# Altium project Joulemeter.PrjPCB
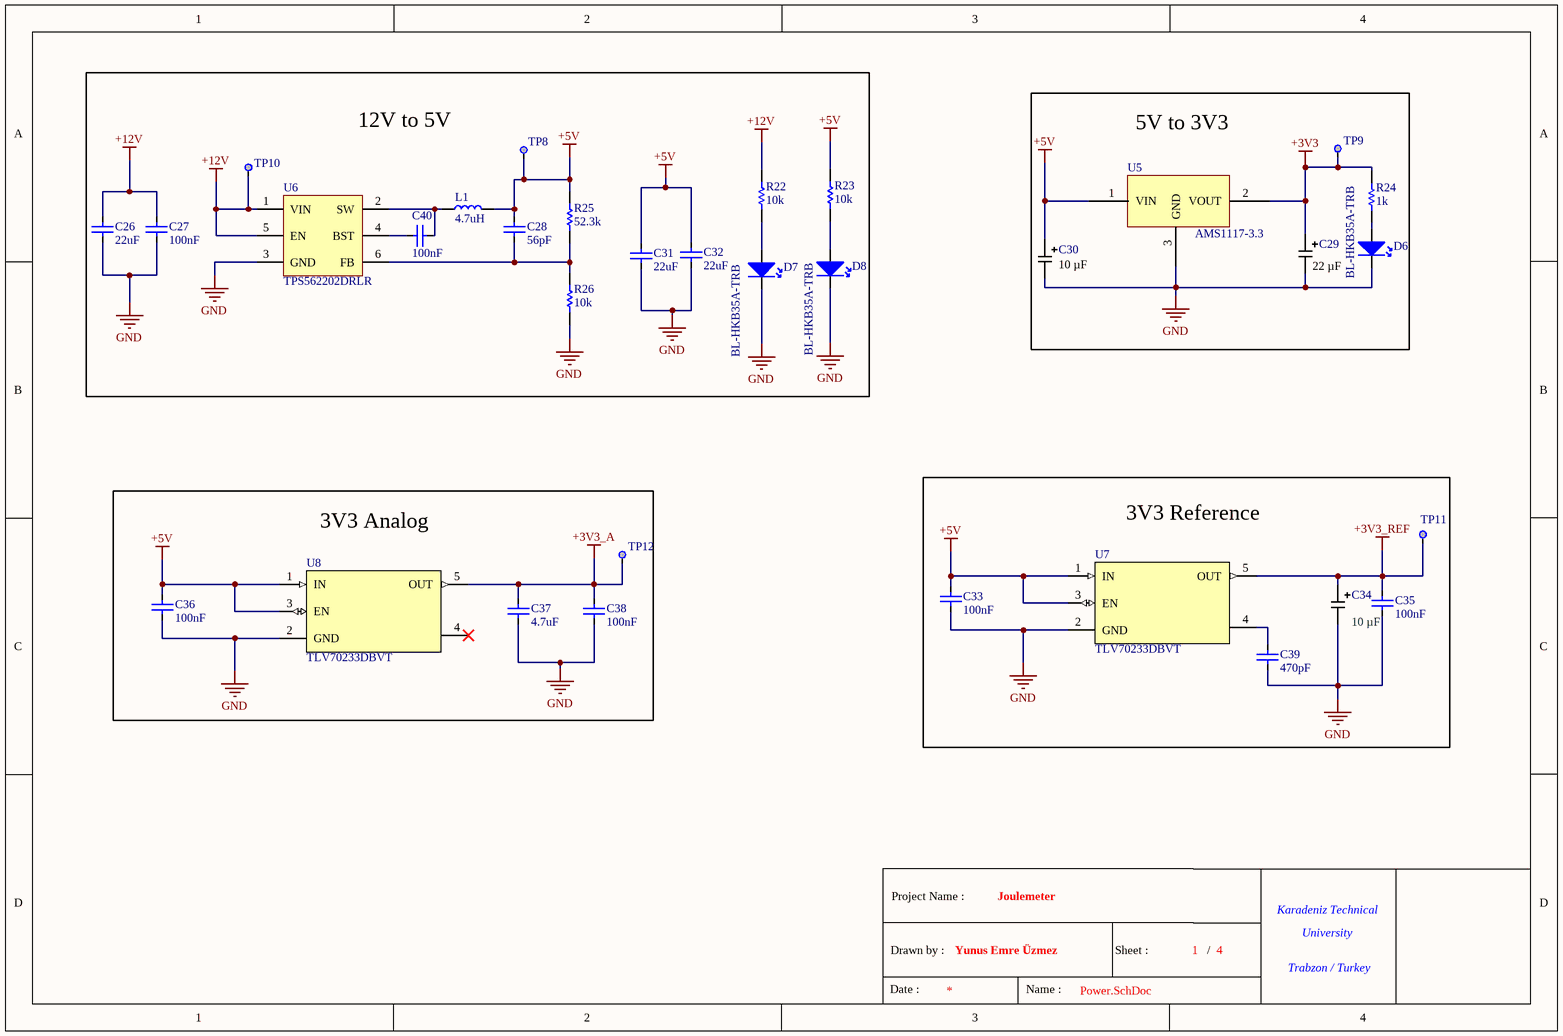
[diagram p0: Power.SchDoc]
Person: Yunus Emre Üzmez; Project: Joulemeter
4 sheets, 130 parts. Net scope: global (net labels, ports and power ports of the same name join across sheets).
Board file: joulmeter.PcbDoc
Sheets:
  Power.SchDoc
  Peripheral.SchDoc
  MCU.SchDoc
  Connectors.SchDoc

## Sheet Power.SchDoc
size A4; DocumentNumber: 1; SheetNumber: 1; SheetTotal: 4

### Parts
(Parts that share a designator on the sheet are numbered #1, #2 ... from top to bottom, then left to right.)
*#1  Title Block  (value not drawn)  (graphical)
C26  22uF  [CAP-1210]
C27  100nF  [CAP-0603]
C28  56pF  [CAP-0603]
C29  Capacitance: 22 µF  [KEMET_CAP_TAN-B]  (hidden comment: T491B226K020AT)
C30  Capacitance: 10 µF  [KEMET_CAP_TAN-B]  (hidden comment: T491B106M016AT)
C31  22uF  [CAP-1210]
C32  22uF  [CAP-1210]
C33  100nF  [CAP-0603]
C34  Capacitance: 10 µF  [KEMET_CAP_TAN-B]  (hidden comment: T491B106M016AT)
C35  100nF  [CAP-0603]
C36  100nF  [CAP-0603]
C37  4.7uF  [CAP-0805]
C38  100nF  [CAP-0603]
C39  470pF  [CAP-0603]
C40  100nF  [CAP-0603]
D6  BL-HKB35A-TRB  [LED-0805]
D7  BL-HKB35A-TRB  [LED-0805]
D8  BL-HKB35A-TRB  [LED-0805]
L1  4.7uH  [IND_EATON_DR125-4R7-R]
R22  10k  [RES-0603]
R23  10k  [RES-0603]
R24  1k  [RES-0603]
R25  52.3k  [RES-0603]
R26  10k  [RES-0603]
TP8  Test Point  [0.8mm Test Point]  (value not drawn)  (no BOM)
TP9  Test Point  [0.8mm Test Point]  (value not drawn)  (no BOM)
TP10  Test Point  [0.8mm Test Point]  (value not drawn)  (no BOM)
TP11  Test Point  [0.8mm Test Point]  (value not drawn)  (no BOM)
TP12  Test Point  [0.8mm Test Point]  (value not drawn)  (no BOM)
U5  AMS1117-3.3  [SOT-223]
U6  TPS562202DRLR  [SOT-563]
U7  TLV70233DBVT  [SOT23-5]
U8  TLV70233DBVT  [SOT23-5]

### Blocks framed on the sheet
12V to 5V: C26-C28 C31 C32 C40 D7 D8 L1 R22 R23 R25 R26 TP8 TP10 U6
5V to 3V3: C29 C30 D6 R24 TP9 U5
3V3 Analog: C36-C38 TP12 U8
3V3 Reference: C33-C35 C39 TP11 U7

### Nets
+3V3: C29.1 R24.1 TP9.1 U5.2(VOUT)
+3V3_A: C37.2 C38.2 TP12.1 U8.5(OUT)
+3V3_REF: C34.1 C35.2 TP11.1 U7.5(OUT)
+5V: C28.2 C30.1 C31.2 C32.2 C33.2 C36.2 L1.2 R23.2 R25.2 TP8.1 U5.1(VIN) U7.1(IN) U7.3(EN) U8.1(IN) U8.3(EN)
+12V: C26.2 C27.2 R22.2 TP10.1 U6.1(VIN) U6.5(EN)
GND: C26.1 C27.1 C29.2 C30.2 C31.1 C32.1 C33.1 C34.2 C35.1 C36.1 C37.1 C38.1 C39.1 D6.2(K) D7.2(K) D8.2(K) R26.1 U5.3(GND) U6.3(GND) U7.2(GND) U8.2(GND)
NetC28_1: C28.1 R25.1 R26.2 U6.6(FB)
NetC39_2: C39.2 U7.4
NetC40_1: C40.1 L1.1 U6.2(SW)
NetC40_2: C40.2 U6.4(BST)
NetD6_1: D6.1(A) R24.2
NetD7_1: D7.1(A) R22.1
NetD8_1: D8.1(A) R23.1

Not connected (* = marked no-connect by the designer): U8 4*

### Notes on the sheet
- (in symbol Title Block) Project Name :; Karadeniz Technical; University; Drawn by :; Sheet :; /; Trabzon / Turkey; Date :; Name :

### Library data of the parts
*#1 = Title Block: Standart Title Block
C26 C31 C32 = CL32B226KAJNNNE: Manufacturer: Samsung Electro-Mechanics; Temperature Coefficient: X7R; Voltage: 25V; Library Reference: Capacitor; Tolerance: %10; Man Code: CL32B226KAJNNNE; Value: 22uF; Footprint: 1210; Component Type: Ceramic Capacitor
C27 C33 C35 C36 C38 C40 = CGA3E2X7R1H104K080AA: Manufacturer: TDK; Temperature Coefficient: X7R; Voltage: 50V; Library Reference: Capacitor; Tolerance: %10; Man Code: CGA3E2X7R1H104K080AA; Value: 100nF; Footprint: 0603; Component Type: Ceramic Capacitor
C28 = GCM1885C2A560FA16D: Manufacturer: Murata; Library Reference: Capacitor; Tolerance: %1; Temperature Coefficient: C0G; Voltage: 100V; Man Code: GCM1885C2A560FA16D; Value: 56pF; Footprint: 0603; Component Type: Ceramic Capacitor
C29 = T491B226K020AT: CAP TANT 22UF 10% 20V 1411; Manufacturer: KEMET; Manufacturer Size Code: B; Type: Molded; ESR (Equivalent Series Resistance): 4 Ohm; Lifetime @ Temp.: 2000 Hrs @ 125°C; Series: T491; Package: Tape & Reel (TR); Tolerance: ±10%; Operating Temperature: -55°C ~ 125°C; Mounting Type: Surface Mount; Package / Case: 1411 (3528 Metric); Size / Dimension: 0.138" L x 0.110" W (3.50mm x 2.80mm); Height - Seated (Max): 0.083" (2.10mm); Lead Spacing: -; Ratings: -; Features: General Purpose; Failure Rate: -; Voltage - Rated: 20 V; Ozdisan Link: https://ozdisan.com/pasif-komponentler/kondansatorler/tantal-kondansatorler/T491B226K020AT; Digikey Link: https://www.digikey.com/en/products/detail/kemet/T491B226K020AT/1842086; Farnell TR Link: https://tr.farnell.com/kemet/t491b226k020at/cap-22-f-20v-10/dp/2321214?st=t491b226k020at; Mouser Link: https://www.mouser.com.tr/ProductDetail/KEMET/T491B226K020AT?qs=2QcrrtqkWlnFmgDgM5wdlA%3D%3D
C30 C34 = T491B106M016AT: CAP TANT 10UF 20% 16V 1411; Manufacturer: KEMET; Manufacturer Size Code: B; Type: Molded; ESR (Equivalent Series Resistance): 2.5 Ohm; Lifetime @ Temp.: 2000 Hrs @ 125°C; Series: T491; Package: Tape & Reel (TR); Tolerance: ±20%; Operating Temperature: -55°C ~ 125°C; Mounting Type: Surface Mount; Package / Case: 1411 (3528 Metric); Size / Dimension: 0.138" L x 0.110" W (3.50mm x 2.80mm); Height - Seated (Max): 0.083" (2.10mm); Lead Spacing: -; Ratings: -; Features: General Purpose; Failure Rate: -; Voltage - Rated: 16 V; Ozdisan Link: https://ozdisan.com/pasif-komponentler/kondansatorler/tantal-kondansatorler/T491B106M016AT; Digikey Link: https://www.digikey.com/en/products/detail/kemet/T495B475M025ZTE750/8764094; Farnell TR Link: https://tr.farnell.com/kemet/t491b106m016at/cap-10-f-16v-20/dp/2462772?st=t491b106m016at; Mouser Link: https://www.mouser.com.tr/ProductDetail/KEMET/T491B106M016AT?qs=WydH9nGI6cAnkEyQJLjSzA%3D%3D
C37 = C0805C475K3RACAUTO: Manufacturer: Kemet; Temperature Coefficient: X7R; Voltage: 25V; Library Reference: Capacitor; Tolerance: %10; Man Code: C0805C475K3RACAUTO; Value: 4.7uF; Footprint: 0805; Component Type: Ceramic Capacitor
C39 = CL10B471KB8NNNC: Manufacturer: Samsung; Voltage: 50V; Tolerance: %10; Component Type: Capacitor; Footprint: 0603; Man Code: CL10B471KB8NNNC; Value: 470pF
D6-D8 = BL-HKB35A-TRB: Manufacturer: BRIGHT LED; Colour: Yellow; Vf: 2.2V; Library Reference: Miscellaneous; Luminous Intensity: 94mcd; If: 20mA; Lens Transparency: Water Clear; Man Code: BL-HKB35A-TRB; Footprint: 0805; Component Type: Led
L1 = DR125-4R7-R: Manufacturer: Eaton; Max Dc Resistance: 10.5mOhm; Tolerance: %20; Max DC Current: 7.18A; Library Reference: Inductor; Man Code: DR125-4R7-R; Value: 4.7uH; Footprint: Surface Mount (12.5mm* 12.5mm); Component Type: Fixed Inductor
R22 R23 R26 = CRCW060310K0FKEA: Manufacturer: Vishay; Tolerance: %1; Power: 0.1W; Library Reference: Resistor; Man Code: CRCW060310K0FKEA; Value: 10k; Footprint: 0603; Component Type: Chip Resistor
R24 = CRCW06031K00FKEAC: Manufacturer: Vishay; Library Reference: Resistor; Tolerance: %1; Power: 0.1W; Man Code: CRCW06031K00FKEAC; Footprint: 0603; Component Type: Chip Resistor; Value: 1k
R25 = ERJ-3EKF5232V: Manufacturer: Panasonic; Tolerance: %1; Power: 0.1W; Library Reference: Resistor; Man Code: ERJ-3EKF5232V; Value: 52.3k; Footprint: 0603; Component Type: Chip Resistor
TP8-TP12 = Test Point: Library Reference: Miscellaneous; Component Type: Test Point
U5 = AMS1117-3.3: Manufacturer: Monolithic; Componenet Type: Regulator; Output Voltage: 3.3V; Output Current: 1A; Man Code: AMS1117-3.3
U6 = TPS562202DRLR: Manufacturer: Texas Instruments; Library Reference: Integrated_Circuit; Man Code: TPS562202DRLR; Component Type: Switcher
U7 U8 = TLV70233DBVT: Manufacturer: TEXAS; Current: 300mA; Voltage: 3.3V; Component Type: LDO; Man Code: TLV70233DBVT

## Sheet Peripheral.SchDoc
size A4; DocumentNumber: 2; SheetNumber: 2; SheetTotal: 4
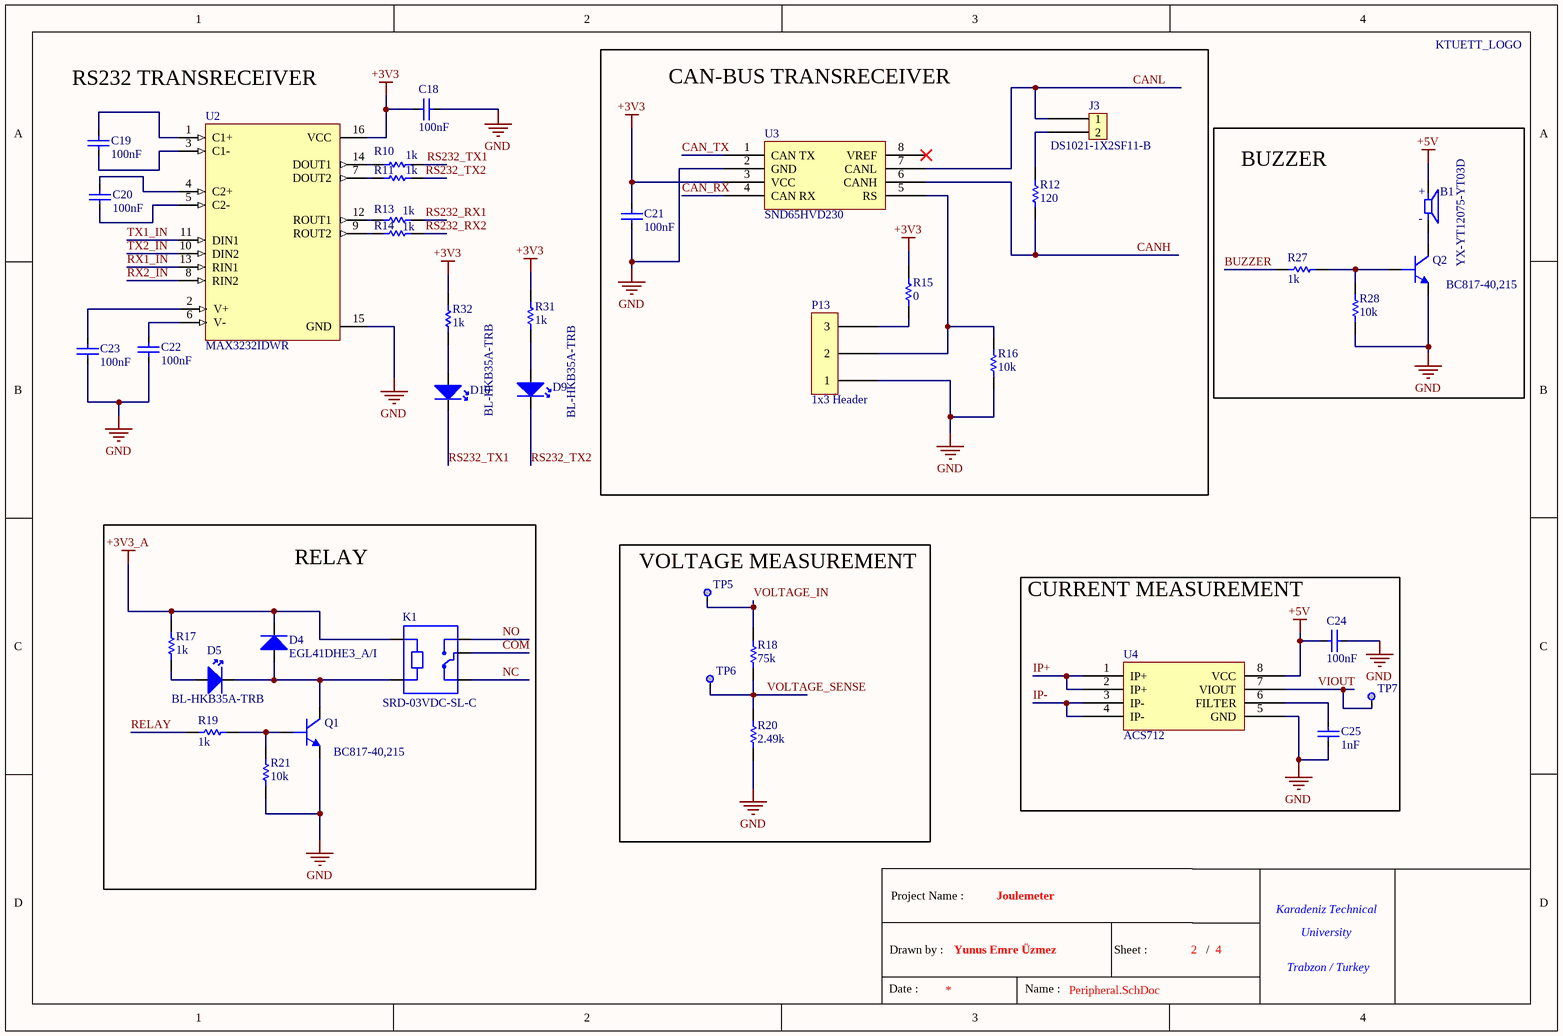
[diagram p1: Peripheral.SchDoc]

### Parts
(Parts that share a designator on the sheet are numbered #1, #2 ... from top to bottom, then left to right.)
1  KTUETT_LOGO  [KTUETT_LOGO]  (value not drawn)  (no BOM)
*#2  Title Block  (value not drawn)  (graphical)
B1  YX-YT12075-YT03D  [BUZZER]
C18  100nF  [CAP-0603]
C19  100nF  [CAP-0603]
C20  100nF  [CAP-0603]
C21  100nF  [CAP-0603]
C22  100nF  [CAP-0603]
C23  100nF  [CAP-0603]
C24  100nF  [CAP-0603]
C25  1nF  [CAP-0603]
D4  EGL41DHE3_A/I  [DO-213AB]
D5  BL-HKB35A-TRB  [LED-0805]
D9  BL-HKB35A-TRB  [LED-0805]
D10  BL-HKB35A-TRB  [LED-0805]
J3  DS1021-1X2SF11-B  [1x2 HEADER]
K1  SRD-03VDC-SL-C  [RELAY]
P13  1x3 Header  [1x3 Header (2.54 mm)]
Q1  BC817-40,215  [SOT23-3]
Q2  BC817-40,215  [SOT23-3]
R10  1k  [RES-0603]
R11  1k  [RES-0603]
R12  120  [RES-0603]
R13  1k  [RES-0603]
R14  1k  [RES-0603]
R15  0  [RES-0603]
R16  10k  [RES-0603]
R17  1k  [RES-0603]
R18  75k  [RES-0603]
R19  1k  [RES-0603]
R20  2.49k  [RES-0603]
R21  10k  [RES-0603]
R27  1k  [RES-0603]
R28  10k  [RES-0603]
R31  1k  [RES-0603]
R32  1k  [RES-0603]
TP5  Test Point  [0.8mm Test Point]  (value not drawn)  (no BOM)
TP6  Test Point  [0.8mm Test Point]  (value not drawn)  (no BOM)
TP7  Test Point  [0.8mm Test Point]  (value not drawn)  (no BOM)
U2  MAX3232IDWR  [SOIC-16]
U3  SND65HVD230  [SOIC-8]
U4  ACS712  [SOIC-8]

### Blocks framed on the sheet
CAN-BUS TRANSRECEIVER: C21 J3 P13 R12 R15 R16 U3
BUZZER: B1 Q2 R27 R28
RELAY: D4 D5 K1 Q1 R17 R19 R21
VOLTAGE MEASUREMENT: R18 R20 TP5 TP6
CURRENT MEASUREMENT: C24 C25 TP7 U4

### Nets
+3V3: C18.2 C21.1 R15.2 R31.2 R32.2 U2.16(VCC) U3.3(VCC)
+3V3_A: D4.2(K) K1.A1 R17.1
+5V: B1.P C24.1 U4.8(VCC)
GND: C18.1 C21.2 C22.2 C23.2 C24.2 C25.1 P13.1 Q1.2(E) Q2.2(E) R16.1 R20.1 R21.1 R28.1 U2.15(GND) U3.2(GND) U4.5(GND)
BUZZER: R27.2
CAN_RX: U3.4(CAN_RX)
CAN_TX: U3.1(CAN_TX)
CANH: R12.2 U3.6(CANH)
CANL: J3.1 U3.7(CANL)
COM: K1.COM
IP+: U4.1(IP+) U4.2(IP+)
IP-: U4.3(IP-) U4.4(IP-)
NC: K1.NC
NO: K1.NO
RELAY: R19.2
RS232_RX1: R13.1
RS232_RX2: R14.1
RS232_TX1: D10.2(K) R10.1
RS232_TX2: D9.2(K) R11.1
RX1_IN: U2.13(RIN1)
RX2_IN: U2.8(RIN2)
TX1_IN: U2.11(DIN1)
TX2_IN: U2.10(DIN2)
VIOUT: TP7.1 U4.7(VIOUT)
VOLTAGE_IN: R18.1 TP5.1
VOLTAGE_SENSE: R18.2 R20.2 TP6.1
NetB1_N: B1.N Q2.3(C)
NetC19_1: C19.1 U2.1(C1+)
NetC19_2: C19.2 U2.3(C1-)
NetC20_1: C20.1 U2.4(C2+)
NetC20_2: C20.2 U2.5(C2-)
NetC22_1: C22.1 U2.6(V-)
NetC23_1: C23.1 U2.2(V+)
NetC25_2: C25.2 U4.6(FILTER)
NetD4_1: D4.1(A) D5.2(K) K1.A2 Q1.3(C)
NetD5_1: D5.1(A) R17.2
NetD9_1: D9.1(A) R31.1
NetD10_1: D10.1(A) R32.1
NetJ3_2: J3.2 R12.1
NetP13_2: P13.2 R16.2 U3.5(RS)
NetP13_3: P13.3 R15.1
NetQ1_1: Q1.1(B) R19.1 R21.2
NetQ2_1: Q2.1(B) R27.1 R28.2
NetR10_2: R10.2 U2.14(DOUT1)
NetR11_2: R11.2 U2.7(DOUT2)
NetR13_2: R13.2 U2.12(ROUT1)
NetR14_2: R14.2 U2.9(ROUT2)

Not connected (* = marked no-connect by the designer): U3 8(VREF)*

### Notes on the sheet
- RS232 TRANSRECEIVER
- (in symbol Title Block) Project Name :; Karadeniz Technical; University; Drawn by :; Sheet :; /; Trabzon / Turkey; Date :; Name :
- (in symbol YX-YT12075-YT03D) +; -

### Library data of the parts
1 = KTUETT_LOGO: Library Reference: Miscellaneous; Component Type: LOGO
*#2 = Title Block: Standart Title Block
B1 = YX-YT12075-YT03D: Manufacturer: YXDZ; Voltage: 3V; Component Type: Buzzer; Man Code: YX-YT12075-YT03D; Mounting Type: THT; Dimensions(mm): 12.00X7.50
C18-C24 = CGA3E2X7R1H104K080AA: as C27 on sheet Power; Man Code: CGA3E2X7R1H104K080AA; Value: 100nF; Footprint: 0603; Component Type: Ceramic Capacitor
C25 = C0603C102F5GACTU: Manufacturer: KEMET; Tolerance: %1; Voltage: 50V; Value: 1nF; Footprint: 0603; Component Type: Chip Capacitor; Man Code: C0603C102F5GACTU
D4 = EGL41DHE3_A/I: Manufacturer: VISHAY; Current: 1A; Voltage: 200; Component Type: Diode; Man Code: EGL41DHE3_A/I
D5 D9 D10 = BL-HKB35A-TRB: as D6 on sheet Power; Man Code: BL-HKB35A-TRB; Footprint: 0805; Component Type: Led
J3 = DS1021-1X2SF11-B: Manufacturer: KLS Electronic; Number of Row: 1; Pitch: 2.54mm; Component Type: Header; Man Code: DS1021-1X2SF11-B; Number of Pins: 2
K1 = SRD-03VDC-SL-C: Manufacturer: Songle; Coil Voltage: 3V; Contact Rating Current: 10A; Component Type: Relay; Man Code: SRD-03VDC-SL-C
P13 = 1x3 Header: Contact Number: 3; Gender: Male; Mounting Angle: 180; Number of Row: 1; Pitch: 2.54 mm; Component Type: Connector; Footprint: *; Library Reference: *; Man Code: 1x3 Header; Mounting Style: THT
Q1 Q2 = BC817-40,215: Library Reference: Transistor; Ic(max): 500mA; VCE(max): 45V; Man Code: BC817-40,215; Component Type: NPN
R10 R11 R13 R14 R17 R19 R27 R31 R32 = CRCW06031K00FKEAC: as R24 on sheet Power; Man Code: CRCW06031K00FKEAC; Footprint: 0603; Component Type: Chip Resistor; Value: 1k
R12 = RC0603FR-07120RL: Manufacturer: YAGEO; Compnenet Type: Chip Resistor; Tolerance: %1; Voltage: 75V; Man Code: RC0603FR-07120RL; Value: 120; Footprint: 0603
R15 = 0603SAJ0000T5E: Manufacturer: ROYALOHM; Tolerance: %5; Voltage: 75V; Component Type: Chip Resistor; Value: 0; Man Code: 0603SAJ0000T5E; Footprint: 0603
R16 R21 R28 = CRCW060310K0FKEA: as R22 on sheet Power; Man Code: CRCW060310K0FKEA; Value: 10k; Footprint: 0603; Component Type: Chip Resistor
R18 = ERJ-3EKF7502V: Manufacturer: Panasonic; Library Reference: Resistor; Tolerance: %1; Power: 0.1W; Man Code: ERJ-3EKF7502V; Footprint: 0603; Component Type: Chip Resistor; Value: 75k
R20 = CRCW06032K49FKEB: Manufacturer: Vishay; Tolerance: %1; Power: 0.1W; Library Reference: Resistor; Man Code: CRCW06032K49FKEB; Value: 2.49k; Footprint: 0603; Component Type: Chip Resistor
TP5-TP7 = Test Point: Library Reference: Miscellaneous; Component Type: Test Point
U2 = MAX3232IDWR: Manufacturer: Texas; Supply Voltage: 3V to 5V; Data Rate: 250kbps; Man Code: MAX3232IDWR; Component Type: IC Driver
U3 = SND65HVD230: Manufacturer: TI; Man Code: SN65HVD230; Component Type: CAN-BUS Transreceiver
U4 = ACS712: Manufacturer: Allegro; Supply Voltage: 5V; Component Type: Hall Effect Sensor; Man Code: ACS712

## Sheet MCU.SchDoc
size A4; DocumentNumber: 3; SheetNumber: 3; SheetTotal: 4
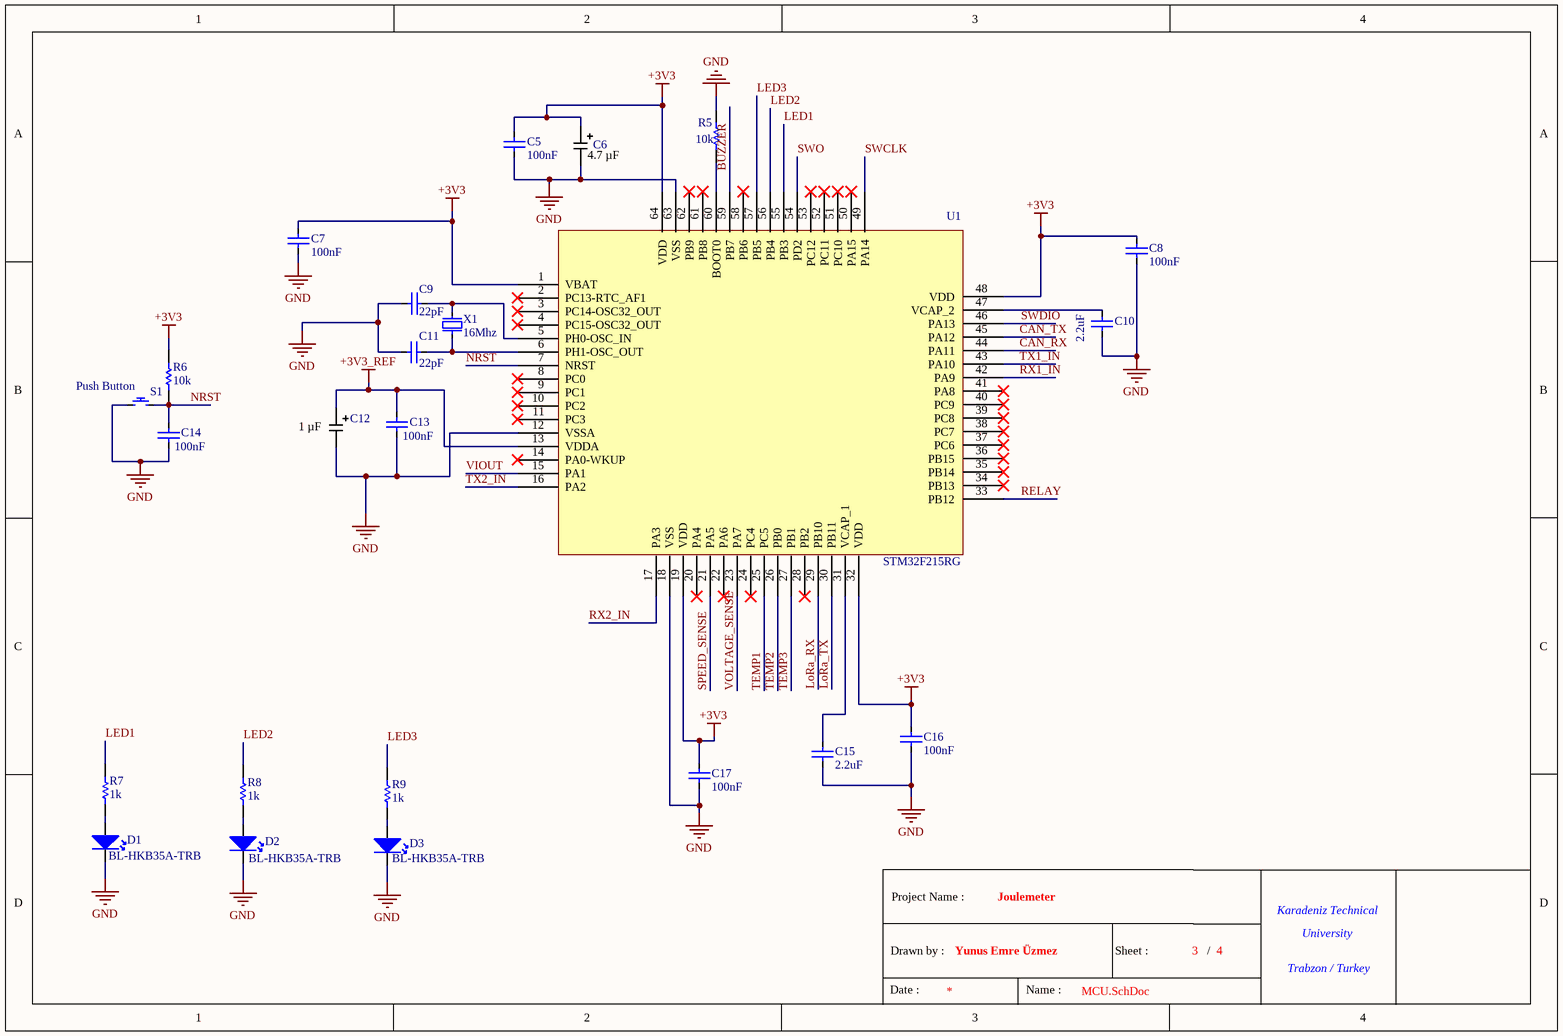
[diagram p2: MCU.SchDoc]

### Parts
(Parts that share a designator on the sheet are numbered #1, #2 ... from top to bottom, then left to right.)
*#3  Title Block  (value not drawn)  (graphical)
C5  100nF  [CAP-0603]
C6  Capacitance: 4.7 µF  [KEMET_CAP_TAN-B]  (hidden comment: T491B475K016AT)
C7  100nF  [CAP-0603]
C8  100nF  [CAP-0603]
C9  22pF  [CAP-0805]
C10  2.2uF  [CAP-0805]
C11  22pF  [CAP-0805]
C12  Capacitance: 1 µF  [KEMET_CAP_TAN-B]  (hidden comment: T491B105K025AT)
C13  100nF  [CAP-0603]
C14  100nF  [CAP-0603]
C15  2.2uF  [CAP-0805]
C16  100nF  [CAP-0603]
C17  100nF  [CAP-0603]
D1  BL-HKB35A-TRB  [LED-0805]
D2  BL-HKB35A-TRB  [LED-0805]
D3  BL-HKB35A-TRB  [LED-0805]
R5  10k  [RES-0603]
R6  10k  [RES-0603]
R7  1k  [RES-0603]
R8  1k  [RES-0603]
R9  1k  [RES-0603]
S1  Push Button  [2.54mm_Push Button]  (no BOM)
U1  STM32F215RG  [LQFP64]
X1  16Mhz  [OSC-THT (11.5*5.00*3.60)]

### Nets
+3V3: C5.2 C6.1 C7.2 C8.2 C16.2 C17.2 R6.1 U1.1(VBAT) U1.19(VDD) U1.32(VDD) U1.48(VDD) U1.64(VDD)
+3V3_REF: C12.1 C13.2 U1.13(VDDA)
GND: C5.1 C6.2 C7.1 C8.1 C9.2 C10.1 C11.1 C12.2 C13.1 C14.1 C15.1 C16.1 C17.1 D1.2(K) D2.2(K) D3.2(K) R5.2 S1.1 U1.12(VSSA) U1.18(VSS) U1.63(VSS)
BUZZER: U1.59(PB7)
CAN_RX: U1.44(PA11)
CAN_TX: U1.45(PA12)
LED1: R7.1 U1.55(PB3)
LED2: R8.1 U1.56(PB4)
LED3: R9.1 U1.57(PB5)
LoRa_RX: U1.29(PB10)
LoRa_TX: U1.30(PB11)
NRST: C14.2 R6.2 S1.2 U1.7(NRST)
RELAY: U1.33(PB12)
RX1_IN: U1.42(PA9)
RX2_IN: U1.17(PA3)
SPEED_SENSE: U1.21(PA5)
SWCLK: U1.49(PA14)
SWDIO: U1.46(PA13)
SWO: U1.54(PD2)
TEMP1: U1.25(PC5)
TEMP2: U1.26(PB0)
TEMP3: U1.27(PB1)
TX1_IN: U1.43(PA10)
TX2_IN: U1.16(PA2)
VIOUT: U1.15(PA1)
VOLTAGE_SENSE: U1.23(PA7)
NetC9_1: C9.1 U1.5(PH0-OSC_IN) X1.2
NetC10_2: C10.2 U1.47(VCAP_2)
NetC11_2: C11.2 U1.6(PH1-OSC_OUT) X1.1
NetC15_2: C15.2 U1.31(VCAP_1)
NetD1_1: D1.1(A) R7.2
NetD2_1: D2.1(A) R8.2
NetD3_1: D3.1(A) R9.2
NetR5_1: R5.1 U1.60(BOOT0)

Not connected (* = marked no-connect by the designer): U1 2(PC13-RTC_AF1)* 3(PC14-OSC32_OUT)* 4(PC15-OSC32_OUT)* 8(PC0)* 9(PC1)* 10(PC2)* 11(PC3)* 14(PA0-WKUP)* 20(PA4)* 22(PA6)* 24(PC4)* 28(PB2)* 34(PB13)* 35(PB14)* 36(PB15)* 37(PC6)* 38(PC7)* 39(PC8)* 40(PC9)* 41(PA8)* 50(PA15)* 51(PC10)* 52(PC11)* 53(PC12)* 58(PB6)* 61(PB8)* 62(PB9)*

### Notes on the sheet
- (in symbol Title Block) Project Name :; Karadeniz Technical; University; Drawn by :; Sheet :; /; Trabzon / Turkey; Date :; Name :

### Library data of the parts
*#3 = Title Block: Standart Title Block
C5 C7 C8 C13 C14 C16 C17 = CGA3E2X7R1H104K080AA: as C27 on sheet Power; Man Code: CGA3E2X7R1H104K080AA; Value: 100nF; Footprint: 0603; Component Type: Ceramic Capacitor
C6 = T491B475K016AT: CAP TANT 4.7UF 10% 16V 1411; Manufacturer: KEMET; Manufacturer Size Code: B; Type: Molded; ESR (Equivalent Series Resistance): 3.5 Ohm; Lifetime @ Temp.: 2000 Hrs @ 125°C; Series: T491; Package: Tape & Reel (TR); Tolerance: ±10%; Operating Temperature: -55°C ~ 125°C; Mounting Type: Surface Mount; Package / Case: 1411 (3528 Metric); Size / Dimension: 0.138" L x 0.110" W (3.50mm x 2.80mm); Height - Seated (Max): 0.083" (2.10mm); Lead Spacing: -; Ratings: -; Features: General Purpose; Failure Rate: -; Voltage - Rated: 16 V; Ozdisan Link: https://ozdisan.com/pasif-komponentler/kondansatorler/tantal-kondansatorler/T491B475K016AT; Digikey Link: https://www.digikey.com/en/products/detail/kemet/T491B475K016AT/818582; Farnell TR Link: https://tr.farnell.com/kemet/t491b475k016at/cap-4-7-f-16v-10-smd/dp/1457453?st=t491b475k016at; Mouser Link: https://www.mouser.com.tr/ProductDetail/KEMET/T491B475K016AT?qs=pWsseJt92L15yATvg%252BRzxw%3D%3D
C9 C11 = CL21C220JBANNNC: Manufacturer: Samsung Electro-Mechanics; Temperature Coefficient: C0G; Voltage: 50V; Library Reference: Capacitor; Tolerance: %5; Man Code: CL21C220JBANNNC; Value: 22pF; Footprint: 0805; Component Type: Ceramic Capacitor
C10 C15 = CL21B225KAFVPNE_1: Manufacturer: Samsung Electro-Mechanics; Library Reference: Capacitor; Temperature Coefficient: X7R; Tolerance: %10; Voltage: 25V; Component Type: Ceramic Capacitor; Footprint: 0805; Man Code: CL21B225KAFVPNE; Value: 2.2uF
C12 = T491B105K025AT: CAP TANT 1UF 10% 25V 1411; Manufacturer: KEMET; Manufacturer Size Code: B; Type: Molded; ESR (Equivalent Series Resistance): 5 Ohm; Lifetime @ Temp.: 2000 Hrs @ 125°C; Series: T491; Package: Tape & Reel (TR); Tolerance: ±10%; Operating Temperature: -55°C ~ 125°C; Mounting Type: Surface Mount; Package / Case: 1411 (3528 Metric); Size / Dimension: 0.138" L x 0.110" W (3.50mm x 2.80mm); Height - Seated (Max): 0.083" (2.10mm); Lead Spacing: -; Ratings: -; Features: General Purpose; Failure Rate: -; Voltage - Rated: 25 V; Ozdisan Link: https://ozdisan.com/pasif-komponentler/kondansatorler/tantal-kondansatorler/T491B105K025AT; Digikey Link: https://www.digikey.com/en/products/detail/kemet/T491B105K025AT/3724810; Farnell TR Link: https://tr.farnell.com/kemet/t491b105k025at/cap-1-f-25v-10/dp/2321211?st=t491b105k025at; Mouser Link: https://www.mouser.com.tr/ProductDetail/KEMET/T491B105K025AT?qs=MSnLt6VizIVP1rbCgJ%252B8hw%3D%3D
D1-D3 = BL-HKB35A-TRB: as D6 on sheet Power; Man Code: BL-HKB35A-TRB; Footprint: 0805; Component Type: Led
R5 R6 = CRCW060310K0FKEA: as R22 on sheet Power; Man Code: CRCW060310K0FKEA; Value: 10k; Footprint: 0603; Component Type: Chip Resistor
R7-R9 = CRCW06031K00FKEAC: as R24 on sheet Power; Man Code: CRCW06031K00FKEAC; Footprint: 0603; Component Type: Chip Resistor; Value: 1k
S1 = Push Button: Library Reference: Other Switches; Component Type: Push Button
U1 = STM32F215RG: Manufacturer: STM; Speed: 120 mHz; Program Memory Size: 1 MB; Supply Voltage: 1.8V-3.6V; Number of Bits: 32; Number of I/O: 51; Component Type: Microcontroller; Man Code: STM32F215RG
X1 = AS49S-16M-FC160F3: Manufacturer: ANSEN; Frequency Tolerance: 20ppm; Frequency Stability: 50ppm; Library Reference: Miscellaneous; Capacitance: 16pF; ESR: 30ohm; Man Code: AS49S-16M-FC160F3; Value: 16Mhz; Component Type: Crystal Oscillator; Footprint: THT (11.5*5.00*3.60)

## Sheet Connectors.SchDoc
size A4; DocumentNumber: 4; SheetNumber: 4; SheetTotal: 4
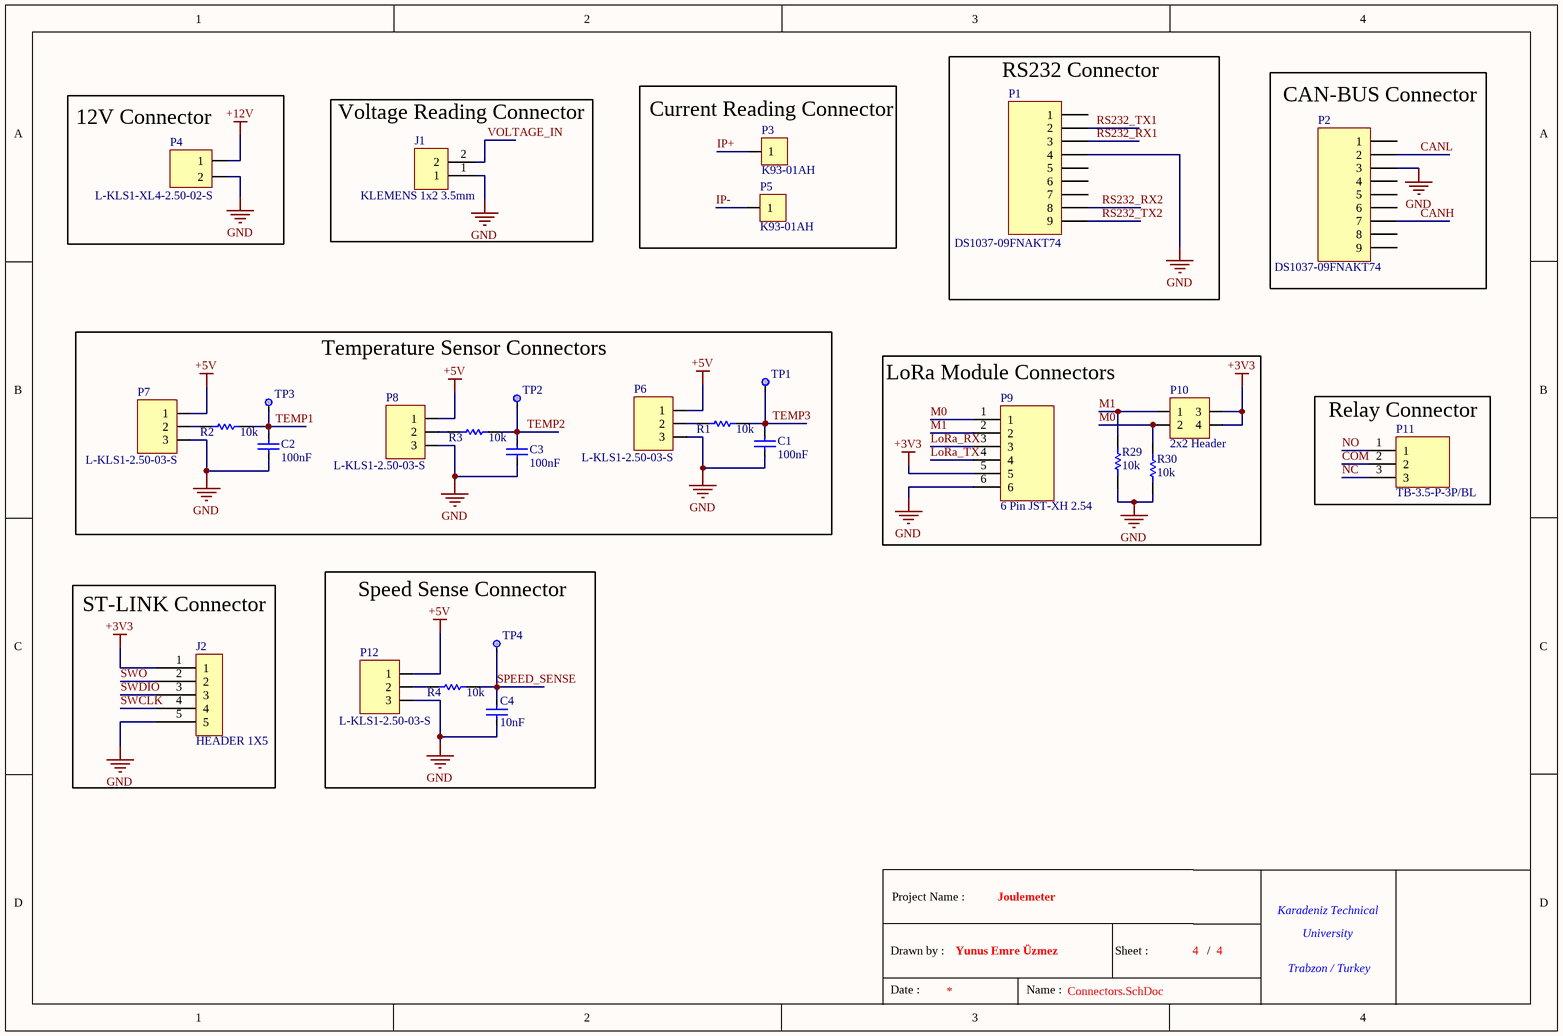
[diagram p3: Connectors.SchDoc]

### Parts
(Parts that share a designator on the sheet are numbered #1, #2 ... from top to bottom, then left to right.)
*#4  Title Block  (value not drawn)  (graphical)
C1  100nF  [CAP-0603]
C2  100nF  [CAP-0603]
C3  100nF  [CAP-0603]
C4  10nF  [CAP-0603]
J1  KLEMENS 1x2 3.5mm  [Klemens 1X2 3.5mm]
J2  HEADER 1X5  [Header 2.54 1x5]
P1  DS1037-09FNAKT74  [D SUB 9PIN FEMALE 90C TH]
P2  DS1037-09FNAKT74  [D SUB 9PIN FEMALE 90C TH]
P3  K93-01AH  [TERM.BLK.5.00MM BARRIER TYPE]
P4  L-KLS1-XL4-2.50-02-S  [2 PIN MALE 180C TH 2.50MM]
P5  K93-01AH  [TERM.BLK.5.00MM BARRIER TYPE]
P6  L-KLS1-2.50-03-S  [3PIN MALE 180C TH 2.5mm]
P7  L-KLS1-2.50-03-S  [3PIN MALE 180C TH 2.5mm]
P8  L-KLS1-2.50-03-S  [3PIN MALE 180C TH 2.5mm]
P9  6 Pin JST-XH 2.54  [1x6 2.50mm TUNIC CONNECTOR]
P10  2x2 Header  [2x2 Header (2.54mm)]
P11  TB-3.5-P-3P/BL  [1x3 3.50MM TERMINAL BLOCK]
P12  L-KLS1-2.50-03-S  [3PIN MALE 180C TH 2.5mm]
R1  10k  [RES-0603]
R2  10k  [RES-0603]
R3  10k  [RES-0603]
R4  10k  [RES-0603]
R29  10k  [RES-0603]
R30  10k  [RES-0603]
TP1  Test Point  [0.8mm Test Point]  (value not drawn)  (no BOM)
TP2  Test Point  [0.8mm Test Point]  (value not drawn)  (no BOM)
TP3  Test Point  [0.8mm Test Point]  (value not drawn)  (no BOM)
TP4  Test Point  [0.8mm Test Point]  (value not drawn)  (no BOM)

### Blocks framed on the sheet
Current Reading Connector: P3 P5
RS232 Connector: P1
CAN-BUS Connector: P2
12V Connector: P4
Voltage Reading Connector: J1
Temperature Sensor Connectors: C1-C3 P6-P8 R1-R3 TP1-TP3
LoRa Module Connectors: P9 P10 R29 R30
Relay Connector: P11
ST-LINK Connector: J2
Speed Sense Connector: C4 P12 R4 TP4

### Nets
+3V3: J2.1 P9.5 P10.3 P10.4
+5V: P6.1 P7.1 P8.1 P12.1
+12V: P4.1
GND: C1.1 C2.1 C3.1 C4.1 J1.1 J2.5 P1.4 P2.3 P4.2 P6.3 P7.3 P8.3 P9.6 P12.3 R29.1 R30.1
CANH: P2.7
CANL: P2.2
COM: P11.2
IP+: P3.1
IP-: P5.1
LoRa_RX: P9.3
LoRa_TX: P9.4
M0: P9.1 P10.2 R30.2
M1: P9.2 P10.1 R29.2
NC: P11.3
NO: P11.1
RS232_RX1: P1.3
RS232_RX2: P1.8
RS232_TX1: P1.2
RS232_TX2: P1.9
SPEED_SENSE: C4.2 R4.1 TP4.1
SWCLK: J2.4
SWDIO: J2.3
SWO: J2.2
TEMP1: C2.2 R2.1 TP3.1
TEMP2: C3.2 R3.1 TP2.1
TEMP3: C1.2 R1.1 TP1.1
VOLTAGE_IN: J1.2
NetP6_2: P6.2 R1.2
NetP7_2: P7.2 R2.2
NetP8_2: P8.2 R3.2
NetP12_2: P12.2 R4.2

Not connected (* = marked no-connect by the designer): P1 1 5 6 7; P2 1 4 5 6 8 9

### Notes on the sheet
- (in symbol Title Block) Project Name :; Karadeniz Technical; University; Drawn by :; Sheet :; /; Trabzon / Turkey; Date :; Name :

### Library data of the parts
*#4 = Title Block: Standart Title Block
C1-C3 = CGA3E2X7R1H104K080AA: as C27 on sheet Power; Man Code: CGA3E2X7R1H104K080AA; Value: 100nF; Footprint: 0603; Component Type: Ceramic Capacitor
C4 = 06031C103K4T4A: Manufacturer: AVX; Temperature Coefficient: X7R; Voltage: 100V; Library Reference: Capacitor; Tolerance: %10; Man Code: 06031C103K4T4A; Value: 10nF; Footprint: 0603; Component Type: Ceramic Capacitor
J1 = KLEMENS 1x2 3.5mm: 1x2 3.5mm Klemens
J2 = HEADER 1X5: 2.54mm 1x5 Header
P1 P2 = DS1037-09FNAKT74: Manufacturer: CONNFLY; Library Reference: Connector; Mating Connector: L-KLS1-213-09-M-L; Gender: Female; Contact Number: 9; Number of Row: 2; Mounting Angle: 90; Current(max): 1.5A; Contact Resistance(max): 20mohm; Pitch: 2.77mm; Man Code: DS1037-09FNAKT74; Component Type: D SUB 9 PIN Female Connector; Mounting Style: Through Hole
P3 P5 = K93-01AH: Manufacturer: GAOSONG; Library Reference: Connector; Mating Connector: M4 Screw; Gender: Male; Contact Number: 4; Number of Row: 2; Mounting Angle: 180; Current(max): 25A; Pitch: 5-7mm; Man Code: K93-01AH; Component Type: TERM.BLK.5.00MM BARRIER TYPE; Mounting Style: Through Hole; Contact Resistance(max): -
P4 = L-KLS1-XL4-2.50-02-S: Manufacturer: KLS ELECTRONIC; Contact Number: 3; Contact Resistance (Max): 10mohm; Current(Max): 3A; Gender: Male; Mounting Angle: 180; Number of Row: 1; Pitch: 2.50mm; Component Type: CONN 2PIN MALE 180C TH 2.5mm; Mounting Style: THT; Man Code: L-KLS1-XL4-2.50-02-S
P6-P8 P12 = L-KLS1-2.50-03-S: Manufacturer: KLS ELECTRONIC; Library Reference: Connector; Mating Connector: L-KLS1-2.50-03-H; Gender: Male; Contact Number: 3; Number of Row: 1; Mounting Angle: 180; Current(max): 3A; Contact Resistance(max): 10mohm; Pitch: 2.5mm; Man Code: L-KLS1-2.50-03-S; Component Type: CONN 3PIN MALE 180C TH 2.5mm; Mounting Style: Through Hole
P9 = 6 Pin JST-XH 2.54: Manufacturer: CONNFLY; Pin Number: 6; Pitch: 2.54mm; Component Type: Connector; Number of rows: 1; Man Code: 6 Pin JST-XH 2.54; Mounting Type: THT
P10 = 2x2 Header (2.54mm): Library Reference: Connector; Gender: Male; Contact Number: 4; Number of Row: 2; Mounting Angle: 180; Pitch: 2.54mm; Man Code: 2x2 Header; Component Type: Header; Manufacturer: -; Mating Connector: -; Mounting Style: Through Hole; Current(max): -; Contact Resistance(max): -
P11 = TB-3.5-P-3P/BL: Manufacturer: NINIGI; Pitch: 3.5mm; Component Type: Connector; Man Code: TB-3.5-P-3P/BL; Number of Rows: 1; Number of Pins: 3; Mounting Type: THT
R1-R4 R29 R30 = CRCW060310K0FKEA: as R22 on sheet Power; Man Code: CRCW060310K0FKEA; Value: 10k; Footprint: 0603; Component Type: Chip Resistor
TP1-TP4 = Test Point: Library Reference: Miscellaneous; Component Type: Test Point

## Nets that join several sheets
+3V3: Power (C29.1 R24.1 TP9.1 U5.2), Peripheral (7 pins), MCU (12 pins), Connectors (J2.1 P9.5 P10.3 P10.4)
+3V3_A: Power (C37.2 C38.2 TP12.1 U8.5), Peripheral (D4.2 K1.A1 R17.1)
+3V3_REF: Power (C34.1 C35.2 TP11.1 U7.5), MCU (C12.1 C13.2 U1.13)
+5V: Power (15 pins), Peripheral (B1.P C24.1 U4.8), Connectors (P6.1 P7.1 P8.1 P12.1)
+12V: Power (6 pins), Connectors (P4.1)
GND: Power (21 pins), Peripheral (16 pins), MCU (21 pins), Connectors (16 pins)
BUZZER: Peripheral (R27.2), MCU (U1.59)
CAN_RX: Peripheral (U3.4), MCU (U1.44)
CAN_TX: Peripheral (U3.1), MCU (U1.45)
CANH: Peripheral (R12.2 U3.6), Connectors (P2.7)
CANL: Peripheral (J3.1 U3.7), Connectors (P2.2)
COM: Peripheral (K1.COM), Connectors (P11.2)
IP+: Peripheral (U4.1 U4.2), Connectors (P3.1)
IP-: Peripheral (U4.3 U4.4), Connectors (P5.1)
LoRa_RX: MCU (U1.29), Connectors (P9.3)
LoRa_TX: MCU (U1.30), Connectors (P9.4)
NC: Peripheral (K1.NC), Connectors (P11.3)
NO: Peripheral (K1.NO), Connectors (P11.1)
RELAY: Peripheral (R19.2), MCU (U1.33)
RS232_RX1: Peripheral (R13.1), Connectors (P1.3)
RS232_RX2: Peripheral (R14.1), Connectors (P1.8)
RS232_TX1: Peripheral (D10.2 R10.1), Connectors (P1.2)
RS232_TX2: Peripheral (D9.2 R11.1), Connectors (P1.9)
RX1_IN: Peripheral (U2.13), MCU (U1.42)
RX2_IN: Peripheral (U2.8), MCU (U1.17)
SPEED_SENSE: MCU (U1.21), Connectors (C4.2 R4.1 TP4.1)
SWCLK: MCU (U1.49), Connectors (J2.4)
SWDIO: MCU (U1.46), Connectors (J2.3)
SWO: MCU (U1.54), Connectors (J2.2)
TEMP1: MCU (U1.25), Connectors (C2.2 R2.1 TP3.1)
TEMP2: MCU (U1.26), Connectors (C3.2 R3.1 TP2.1)
TEMP3: MCU (U1.27), Connectors (C1.2 R1.1 TP1.1)
TX1_IN: Peripheral (U2.11), MCU (U1.43)
TX2_IN: Peripheral (U2.10), MCU (U1.16)
VIOUT: Peripheral (TP7.1 U4.7), MCU (U1.15)
VOLTAGE_IN: Peripheral (R18.1 TP5.1), Connectors (J1.2)
VOLTAGE_SENSE: Peripheral (R18.2 R20.2 TP6.1), MCU (U1.23)